# Altium schematic sheet Top.SchDoc
size A4; SheetNumber: 1; SheetTotal: 11
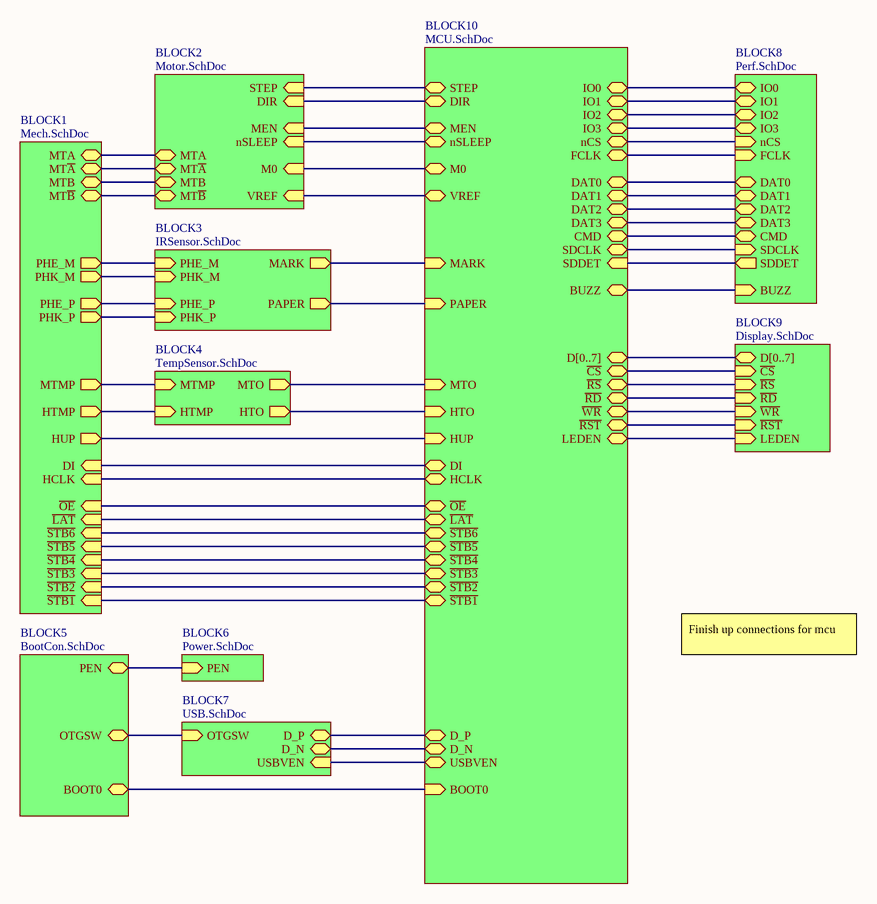
[diagram p0: Top.SchDoc]

## Sub-sheets
BLOCK1 = Mech.SchDoc: HUP (out), DI (in), HCLK (in), ~{LAT} (in), ~{STB6} (in), ~{STB1} (in), ~{STB2} (in), ~{STB3} (in), ~{STB4} (in), ~{STB5} (in), MTB (bidir), MT~{B} (bidir), MTA (bidir), MT~{A} (bidir), PHE_M (out), PHE_P (out), PHK_M (out), PHK_P (out), MTMP (out), HTMP (out), ~{OE} (in)
BLOCK2 = Motor.SchDoc: STEP (in), DIR (in), MEN (in), nSLEEP (in), M0 (in), VREF (in), MTA (bidir), MT~{A} (bidir), MT~{B} (bidir), MTB (bidir)
BLOCK3 = IRSensor.SchDoc: PHE_M (in), PHK_M (in), MARK (out), PAPER (out), PHE_P (in), PHK_P (in)
BLOCK4 = TempSensor.SchDoc: MTMP (in), HTMP (in), MTO (out), HTO (out)
BLOCK5 = BootCon.SchDoc: PEN (bidir), OTGSW (bidir), BOOT0 (bidir)
BLOCK6 = Power.SchDoc: PEN (in)
BLOCK7 = USB.SchDoc: D_P (bidir), D_N (bidir), OTGSW (in), USBVEN (in)
BLOCK8 = Perf.SchDoc: IO0 (bidir), IO1 (bidir), IO2 (bidir), IO3 (bidir), nCS (in), FCLK (in), DAT0 (bidir), DAT1 (bidir), DAT2 (bidir), DAT3 (bidir), CMD (bidir), SDCLK (in), SDDET (out), BUZZ (in)
BLOCK9 = Display.SchDoc: D[0..7] (bidir), ~{CS} (in), ~{RS} (in), ~{RD} (in), ~{WR} (in), ~{RST} (in), LEDEN (in)
BLOCK10 = MCU.SchDoc: BOOT0 (in), USBVEN (bidir), D_N (bidir), D_P (bidir), ~{STB1} (bidir), ~{STB2} (bidir), ~{STB3} (bidir), ~{STB4} (bidir), ~{STB5} (bidir), ~{STB6} (bidir), ~{LAT} (bidir), HCLK (bidir), DI (bidir), HUP (in), HTO (in), MTO (in), PAPER (in), MARK (in), VREF (bidir), M0 (bidir), nSLEEP (bidir), MEN (bidir), DIR (bidir), STEP (bidir), IO0 (bidir), IO1 (bidir), IO2 (bidir), IO3 (bidir), nCS (bidir), FCLK (bidir), DAT0 (bidir), DAT1 (bidir), DAT2 (bidir), DAT3 (bidir), CMD (bidir), SDCLK (bidir), SDDET (in), BUZZ (bidir), D[0..7] (bidir), ~{CS} (bidir), ~{RS} (bidir), ~{RD} (bidir), ~{WR} (bidir), ~{RST} (bidir), LEDEN (bidir), ~{OE} (bidir)

## Nets
(unnamed): sheet BLOCK6/PEN, sheet BLOCK5/PEN
(unnamed): sheet BLOCK5/OTGSW, sheet BLOCK7/OTGSW
(unnamed): sheet BLOCK5/BOOT0, sheet BLOCK10/BOOT0
(unnamed): sheet BLOCK7/D_P, sheet BLOCK10/D_P
(unnamed): sheet BLOCK7/D_N, sheet BLOCK10/D_N
(unnamed): sheet BLOCK7/USBVEN, sheet BLOCK10/USBVEN
(unnamed): sheet BLOCK1/HUP, sheet BLOCK10/HUP
(unnamed): sheet BLOCK1/DI, sheet BLOCK10/DI
(unnamed): sheet BLOCK1/HCLK, sheet BLOCK10/HCLK
(unnamed): sheet BLOCK1/~{LAT}, sheet BLOCK10/~{LAT}
(unnamed): sheet BLOCK1/~{STB6}, sheet BLOCK10/~{STB6}
(unnamed): sheet BLOCK1/~{STB1}, sheet BLOCK10/~{STB1}
(unnamed): sheet BLOCK1/~{STB2}, sheet BLOCK10/~{STB2}
(unnamed): sheet BLOCK1/~{STB3}, sheet BLOCK10/~{STB3}
(unnamed): sheet BLOCK1/~{STB4}, sheet BLOCK10/~{STB4}
(unnamed): sheet BLOCK1/~{STB5}, sheet BLOCK10/~{STB5}
(unnamed): sheet BLOCK1/MTB, sheet BLOCK2/MTB
(unnamed): sheet BLOCK1/MT~{B}, sheet BLOCK2/MT~{B}
(unnamed): sheet BLOCK1/MTA, sheet BLOCK2/MTA
(unnamed): sheet BLOCK1/MT~{A}, sheet BLOCK2/MT~{A}
(unnamed): sheet BLOCK1/PHE_M, sheet BLOCK3/PHE_M
(unnamed): sheet BLOCK1/PHE_P, sheet BLOCK3/PHE_P
(unnamed): sheet BLOCK1/PHK_M, sheet BLOCK3/PHK_M
(unnamed): sheet BLOCK1/PHK_P, sheet BLOCK3/PHK_P
(unnamed): sheet BLOCK1/MTMP, sheet BLOCK4/MTMP
(unnamed): sheet BLOCK1/HTMP, sheet BLOCK4/HTMP
(unnamed): sheet BLOCK1/~{OE}, sheet BLOCK10/~{OE}
(unnamed): sheet BLOCK2/STEP, sheet BLOCK10/STEP
(unnamed): sheet BLOCK2/DIR, sheet BLOCK10/DIR
(unnamed): sheet BLOCK2/MEN, sheet BLOCK10/MEN
(unnamed): sheet BLOCK2/nSLEEP, sheet BLOCK10/nSLEEP
(unnamed): sheet BLOCK2/M0, sheet BLOCK10/M0
(unnamed): sheet BLOCK2/VREF, sheet BLOCK10/VREF
(unnamed): sheet BLOCK4/MTO, sheet BLOCK10/MTO
(unnamed): sheet BLOCK4/HTO, sheet BLOCK10/HTO
(unnamed): sheet BLOCK3/MARK, sheet BLOCK10/MARK
(unnamed): sheet BLOCK3/PAPER, sheet BLOCK10/PAPER
(unnamed): sheet BLOCK8/IO0, sheet BLOCK10/IO0
(unnamed): sheet BLOCK8/IO1, sheet BLOCK10/IO1
(unnamed): sheet BLOCK8/IO2, sheet BLOCK10/IO2
(unnamed): sheet BLOCK8/IO3, sheet BLOCK10/IO3
(unnamed): sheet BLOCK8/nCS, sheet BLOCK10/nCS
(unnamed): sheet BLOCK8/FCLK, sheet BLOCK10/FCLK
(unnamed): sheet BLOCK8/DAT0, sheet BLOCK10/DAT0
(unnamed): sheet BLOCK8/DAT1, sheet BLOCK10/DAT1
(unnamed): sheet BLOCK8/DAT2, sheet BLOCK10/DAT2
(unnamed): sheet BLOCK8/DAT3, sheet BLOCK10/DAT3
(unnamed): sheet BLOCK8/CMD, sheet BLOCK10/CMD
(unnamed): sheet BLOCK8/SDCLK, sheet BLOCK10/SDCLK
(unnamed): sheet BLOCK8/SDDET, sheet BLOCK10/SDDET
(unnamed): sheet BLOCK8/BUZZ, sheet BLOCK10/BUZZ
(unnamed): sheet BLOCK10/~{CS}, sheet BLOCK9/~{CS}
(unnamed): sheet BLOCK10/~{RS}, sheet BLOCK9/~{RS}
(unnamed): sheet BLOCK10/~{RD}, sheet BLOCK9/~{RD}
(unnamed): sheet BLOCK10/~{WR}, sheet BLOCK9/~{WR}
(unnamed): sheet BLOCK10/~{RST}, sheet BLOCK9/~{RST}
(unnamed): sheet BLOCK10/LEDEN, sheet BLOCK9/LEDEN

## Buses and harness runs
bus sheet BLOCK9/D[0..7] = sheet BLOCK10/D[0..7]

## Notes on the sheet
- Finish up connections for mcu